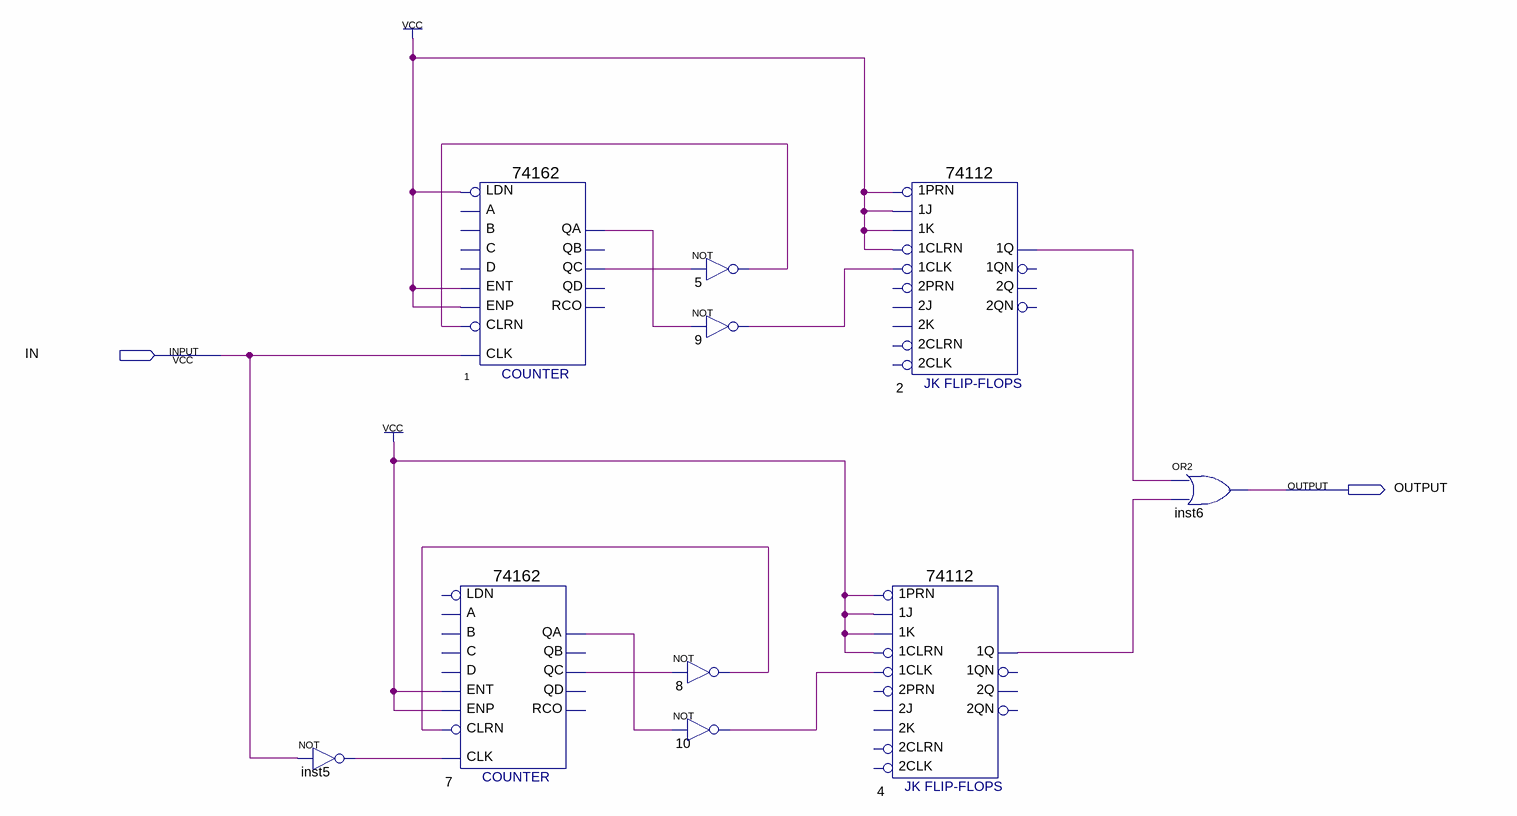
[diagram p0: schematic sheet]
// Quartus schematic 5div.bdf as structural Verilog: 10 symbols, 2 pins
module \5div  (
  input  IN,
  output OUTPUT
);

  wire inst5_out, n1_qa, n1_qc, n2_1q, n4_1q, n5_out, n7_qa, n7_qc, n8_out, n9_out, n10_out;

  not inst5 (inst5_out, IN);
  \74162  u_7 (
    .ENP(1'b1), .ENT(1'b1), .CLRN(n8_out), .CLK(inst5_out), .QA(n7_qa), .QC(n7_qc));  // open: A, LDN, B, C, D, QB, QD, RCO
  \74162  u_1 (
    .LDN(1'b1), .ENP(1'b1), .ENT(1'b1), .CLRN(n5_out), .CLK(IN), .QA(n1_qa), .QC(n1_qc));  // open: A, B, C, D, QB, QD, RCO
  not u_8 (n8_out, n7_qc);
  not u_10 (n10_out, n7_qa);
  not u_5 (n5_out, n1_qc);
  not u_9 (n9_out, n1_qa);
  \74112  u_2 (
    .\1K (1'b1), .\1J (1'b1), .\1PRN (1'b1), .\1CLK (n9_out), .\1CLRN (1'b1), .\1Q (n2_1q));  // open: 2K, 2J, 2PRN, 2CLK, 2CLRN, 1QN, 2Q, 2QN
  \74112  u_4 (
    .\1K (1'b1), .\1J (1'b1), .\1PRN (1'b1), .\1CLK (n10_out), .\1CLRN (1'b1), .\1Q (n4_1q));  // open: 2K, 2J, 2PRN, 2CLK, 2CLRN, 1QN, 2Q, 2QN
  or inst6 (OUTPUT, n2_1q, n4_1q);
endmodule
